# Altium project Motor Control.PrjPcb
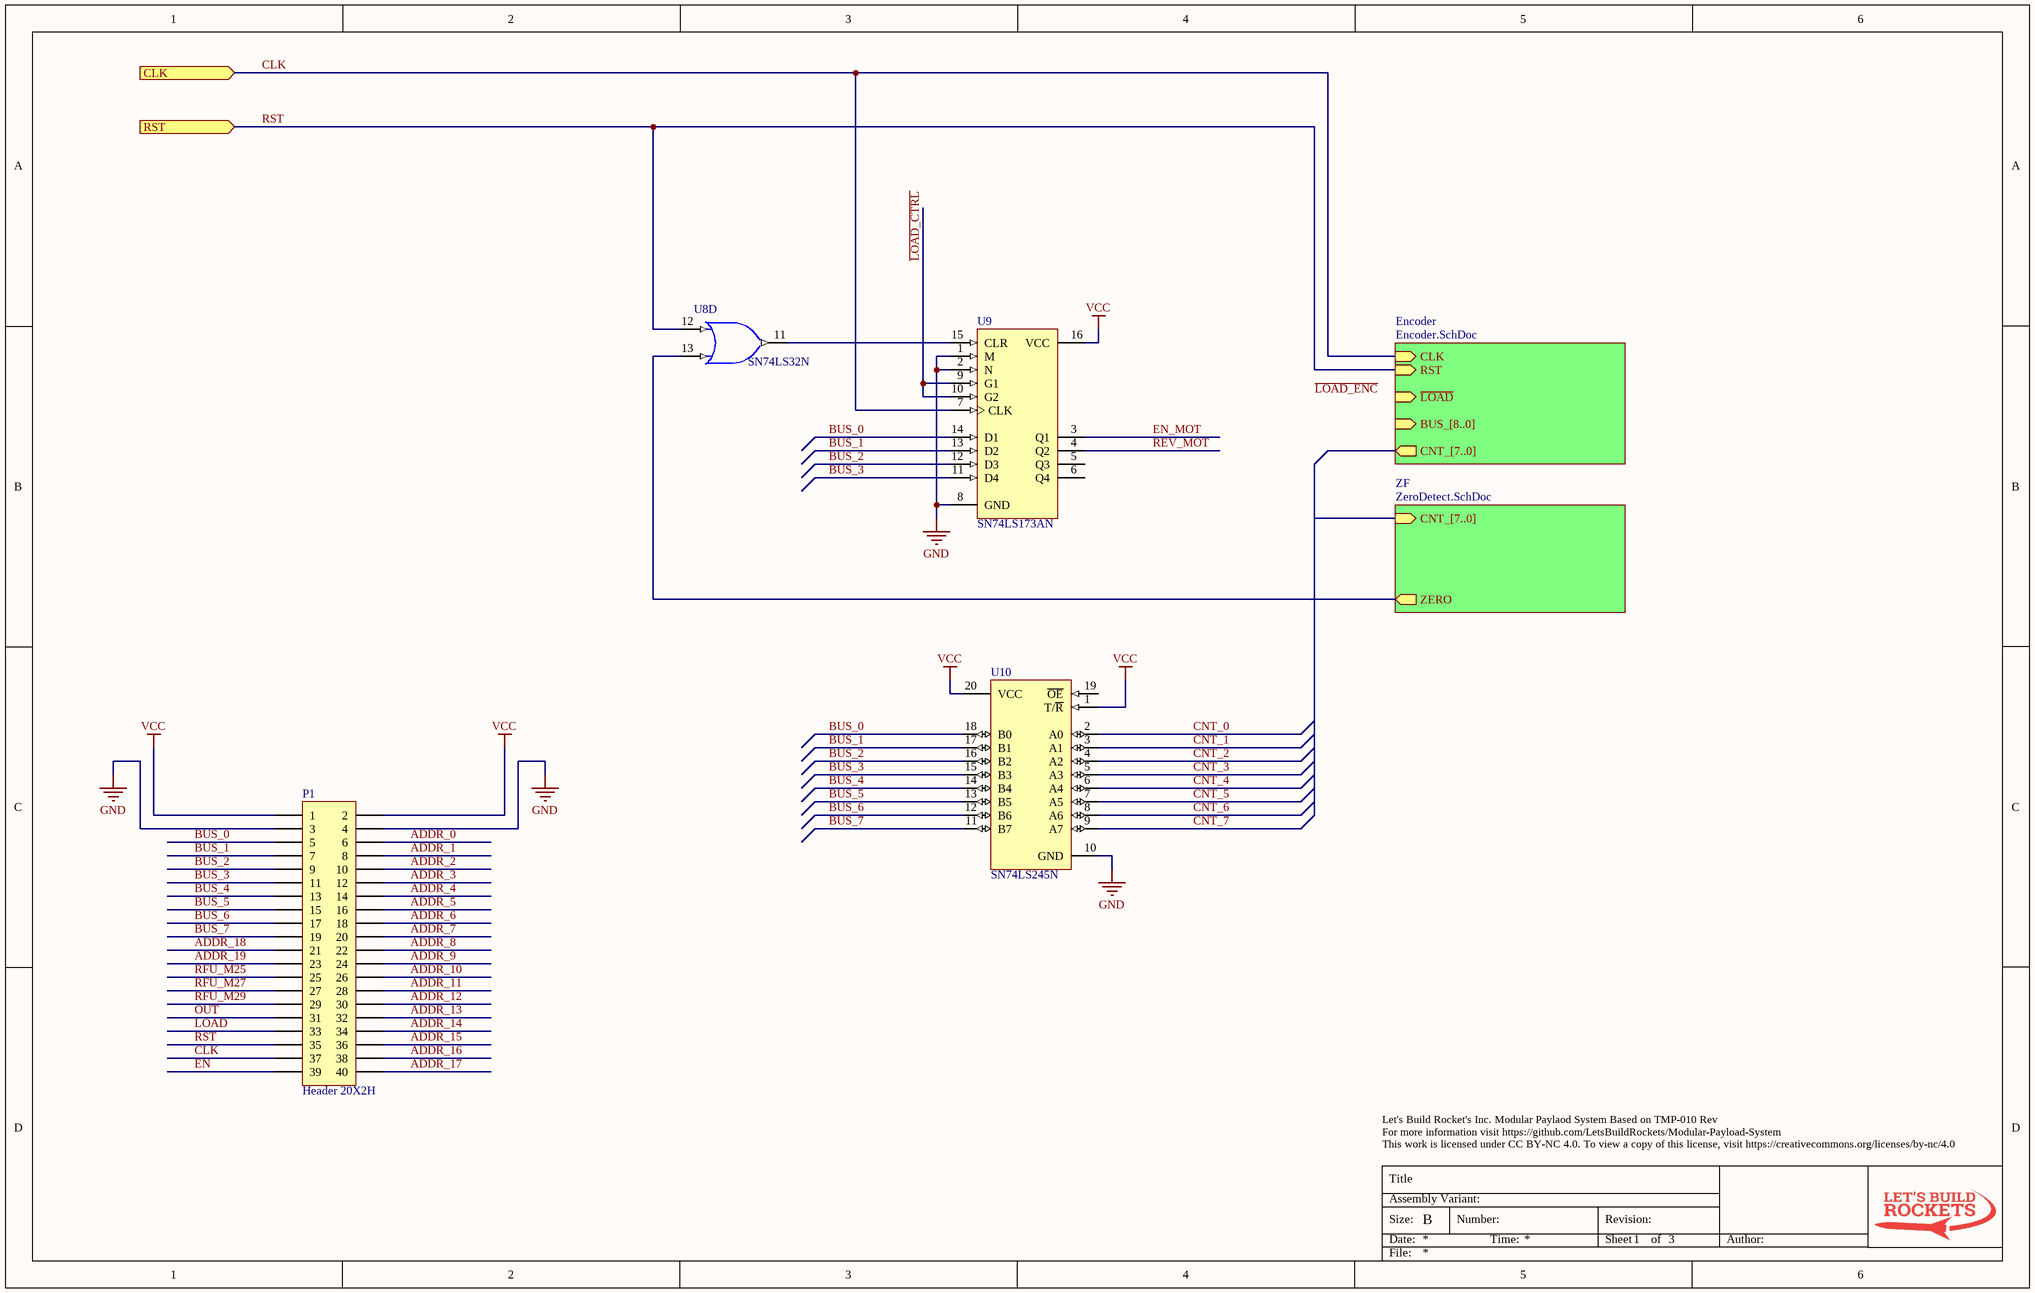
[diagram p0: Register.SchDoc]
3 sheets, 27 parts. Net scope: hierarchical (ports join the sheet entries above them; power ports are global).
Board file: Motor Control.PcbDoc
Sheets:
  Register.SchDoc
    Encoder = Encoder.SchDoc
    ZF = ZeroDetect.SchDoc

## Sheet Register.SchDoc
size B; Author: E. Sims; Organization: Let's Build Rockets Inc.; SheetNumber: 1; SheetTotal: 3

### Parts
P1  Header 20X2H  [HDR2X20H]
U8  SN74LS32N  [N014]  (part D of 4)
U9  SN74LS173AN  [N016D]
U10  SN74LS245N  [N020]

### Sub-sheets
Encoder = Encoder.SchDoc: CNT_[7..0] (out), CLK (in), RST (in), BUS_[8..0] (in), ~{LOAD} (in)
ZF = ZeroDetect.SchDoc: CNT_[7..0] (in), ZERO (out)

### Ports
CLK (in), RST (in)

### Nets
GND: P1.3 P1.4 U8.7(GND) U9.1(M) U9.2(N) U9.8(GND) U10.10(GND)
VCC: P1.1 P1.2 U8.14(VCC) U9.16(VCC) U10.1(T/~{R}) U10.20(VCC)
ADDR_0: P1.6
ADDR_1: P1.8
ADDR_2: P1.10
ADDR_3: P1.12
ADDR_4: P1.14
ADDR_5: P1.16
ADDR_6: P1.18
ADDR_7: P1.20
ADDR_8: P1.22
ADDR_9: P1.24
ADDR_10: P1.26
ADDR_11: P1.28
ADDR_12: P1.30
ADDR_13: P1.32
ADDR_14: P1.34
ADDR_15: P1.36
ADDR_16: P1.38
ADDR_17: P1.40
ADDR_18: P1.21
ADDR_19: P1.23
BUS_0: P1.5 U9.14(D1) U10.18(B0)
BUS_1: P1.7 U9.13(D2) U10.17(B1)
BUS_2: P1.9 U9.12(D3) U10.16(B2)
BUS_3: P1.11 U9.11(D4) U10.15(B3)
BUS_4: P1.13 U10.14(B4)
BUS_5: P1.15 U10.13(B5)
BUS_6: P1.17 U10.12(B6)
BUS_7: P1.19 U10.11(B7)
CLK: P1.37 U9.7(CLK) ; port CLK, sheet Encoder/CLK
CNT_0: U10.2(A0)
CNT_1: U10.3(A1)
CNT_2: U10.4(A2)
CNT_3: U10.5(A3)
CNT_4: U10.6(A4)
CNT_5: U10.7(A5)
CNT_6: U10.8(A6)
CNT_7: U10.9(A7)
EN: P1.39
EN_MOT: U9.3(Q1)
~{LOAD_CTRL}: U9.9(G1) U9.10(G2)
LOAD: P1.33
~{OUT}: P1.31
REV_MOT: U9.4(Q2)
RFU_M25: P1.25
RFU_M27: P1.27
RFU_M29: P1.29
RST: P1.35 U8.12(A) ; port RST, sheet Encoder/RST
ZERO: U8.13(B) ; sheet ZF/ZERO
NetU8_11: U8.11(Y) U9.15(CLR)

Not connected (* = marked no-connect by the designer): U9 5(Q3) 6(Q4); U10 19(~{OE})

### Buses and harness runs
bus sheet Encoder/CNT_[7..0] = sheet ZF/CNT_[7..0]

### Notes on the sheet
- Labels drawn without touching a wire or pin: ~{LOAD_ENC}
- Let's Build Rocket's Inc. Modular Paylaod System Based on TMP-010 Rev
  For more information visit https://github.com/LetsBuildRockets/Modular-Payload-System
  This work is licensed under CC BY-NC 4.0. To view a copy of this license, visit https://creativecommons.org/licenses/by-nc/4.0
- Title
- Size:
- Date:
- Assembly Variant:
- B
- Number:
- Time:
- Revision:
- Sheet
- of
- Author:
- File:

### Library data of the parts
P1 = Header 20x2H: Header, 20-Pin, Dual row, Right Angle; LatestRevisionDate: 17-Jul-2002; LatestRevisionNote: Re-released for DXP Platform.; Publisher: Altium Limited
U8 = SN74LS32N: Quadruple 2-Input Positive-OR Gate; Published: 8-Jun-2000; LatestRevisionDate: 04-Mar-2005; LatestRevisionNote: Stylized 3D Model Added.; DatasheetVersion: Mar-1988; PackageVersion: Oct-1995; PackageReference: N014; Publisher: Altium Limited; PackageDescription: DIP; 14 Leads; Row Spacing 7.62 mm; Pitch 2.54 mm; ComponentLink1Description: Manufacturer Link; ComponentLink1URL: http://www.ti.com/; ComponentLink2Description: Datasheet; ComponentLink2URL: http://www-s.ti.com/sc/ds/sn74ls32.pdf
U9 = SN74LS173AN: 4-Bit D-Type Register with 3-State Outputs; Published: 8-Jun-2000; LatestRevisionDate: 04-Mar-2005; LatestRevisionNote: Stylized 3D Model Added.; DatasheetVersion: Mar-1988; PackageVersion: Oct-1995; PackageReference: N016D; Publisher: Altium Limited; PackageDescription: DIP; 16 Leads; Row Spacing 7.62 mm; Pitch 2.54 mm; Code_JEDEC: MS-001-BB; ComponentLink1Description: Manufacturer Link; ComponentLink1URL: http://www.ti.com/; ComponentLink2Description: Datasheet; ComponentLink2URL: http://www-s.ti.com/sc/ds/sn74ls173a.pdf
U10 = SN74LS245N: Octal Bus Transceiver with 3-State Outputs; Published: 8-Jun-2000; LatestRevisionDate: 04-Mar-2005; LatestRevisionNote: Stylized 3D Model Added.; DatasheetVersion: Mar-1988; PackageVersion: Oct-1995; PackageReference: N020; Publisher: Altium Limited; PackageDescription: DIP; 20 Leads; Row Spacing 7.62 mm; Pitch 2.54 mm; ComponentLink1Description: Manufacturer Link; ComponentLink1URL: http://www.ti.com/; ComponentLink2Description: Datasheet; ComponentLink2URL: http://www-s.ti.com/sc/ds/sn74ls245.pdf

## Sheet Encoder.SchDoc
size B; Author: E. Sims; Organization: Let's Build Rockets Inc.; SheetNumber: 2; SheetTotal: 3
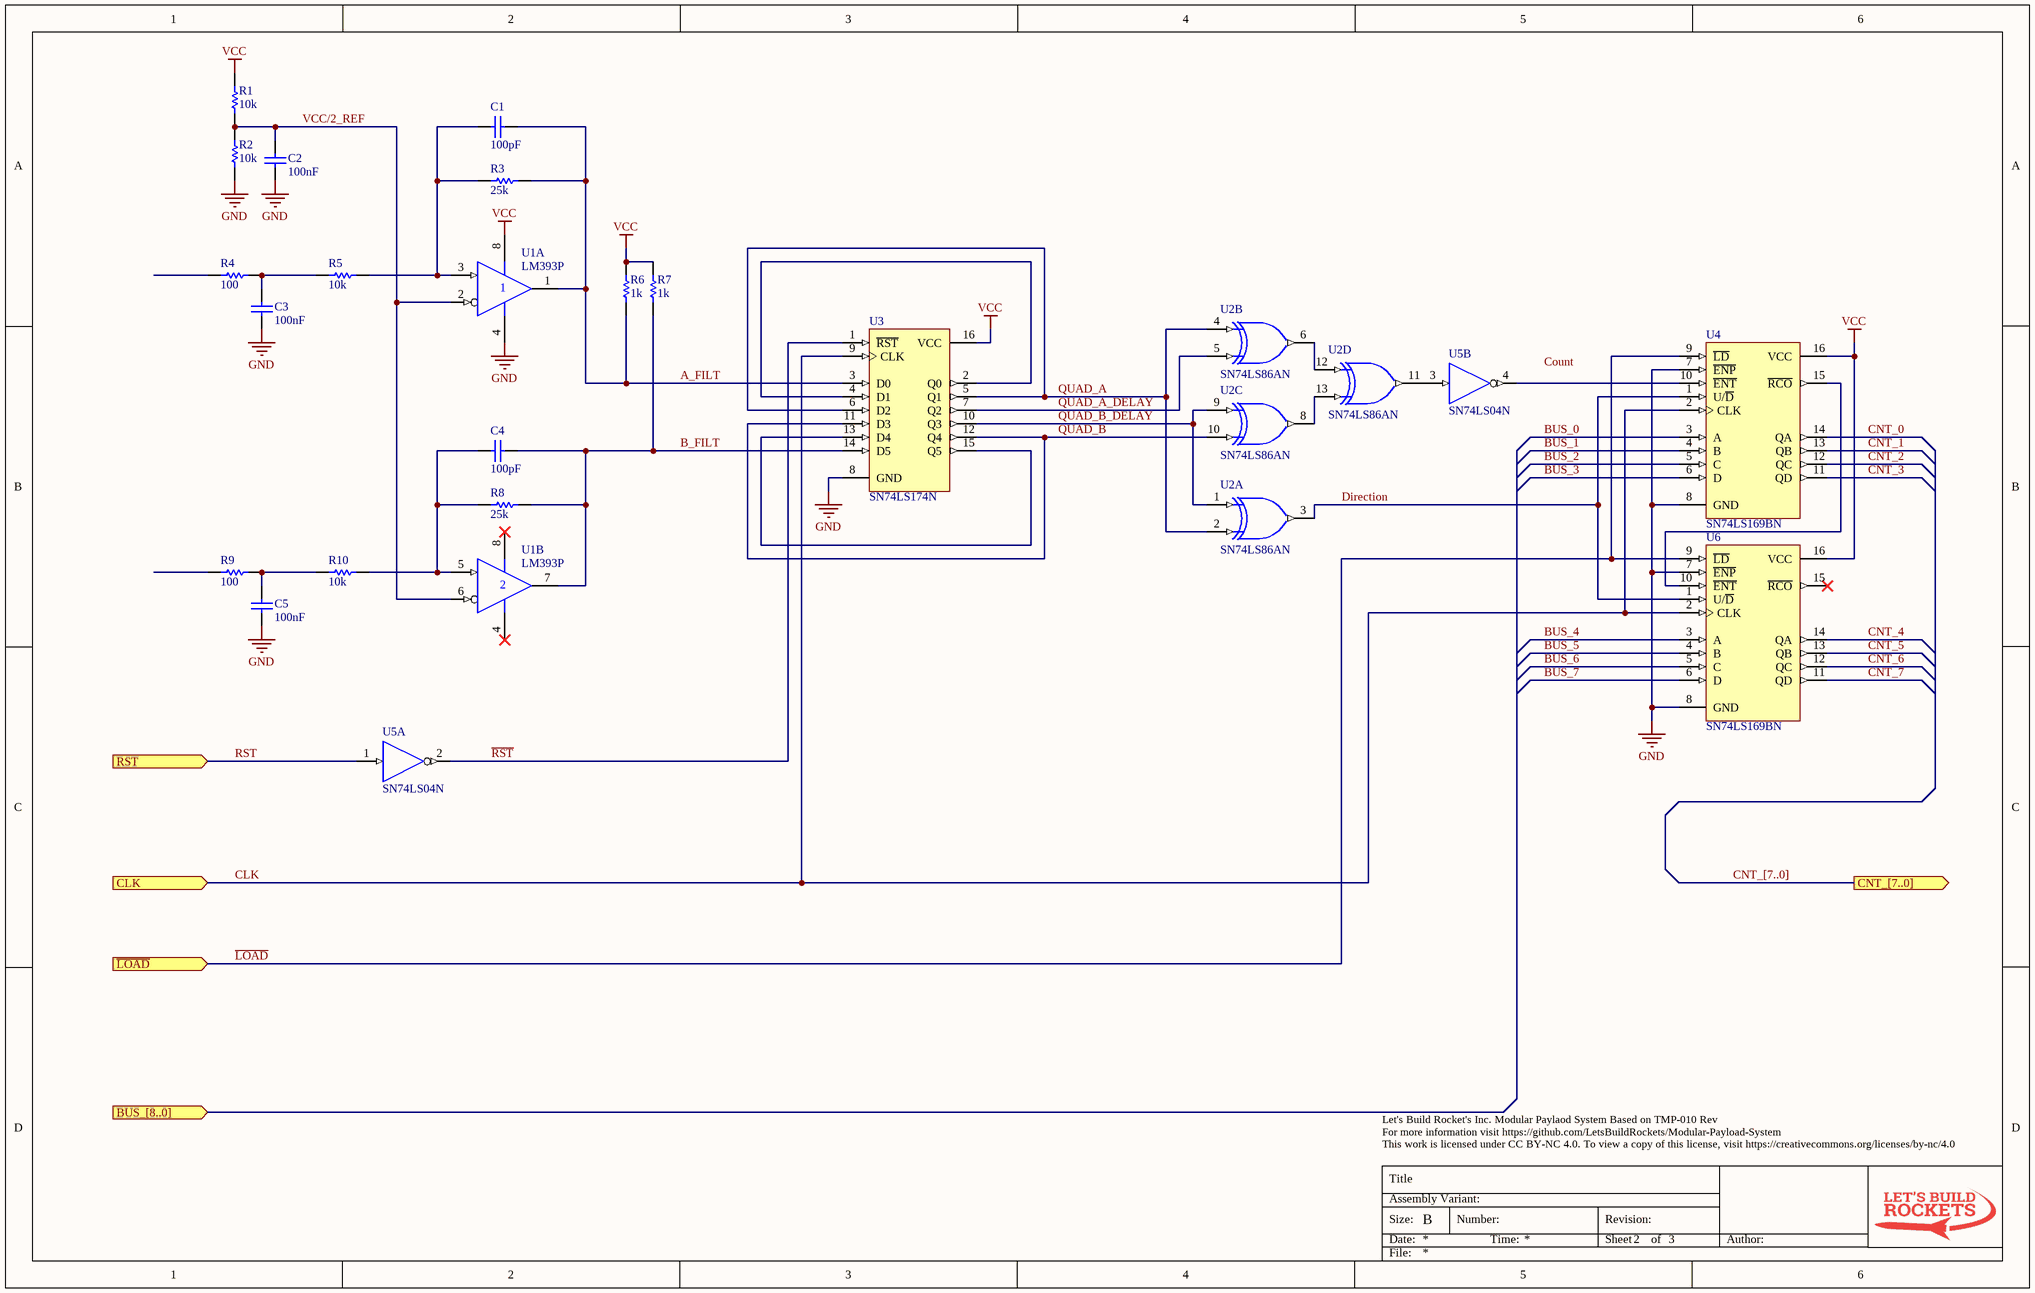
[diagram p1: Encoder.SchDoc]

### Parts
(Parts that share a designator on the sheet are numbered #1, #2 ... from top to bottom, then left to right.)
C1  value 100pF  [RAD-0.3]  (hidden comment: Cap)
C2  value 100nF  [RAD-0.3]  (hidden comment: Cap)
C3  value 100nF  [RAD-0.3]  (hidden comment: Cap)
C4  value 100pF  [RAD-0.3]  (hidden comment: Cap)
C5  value 100nF  [RAD-0.3]  (hidden comment: Cap)
R1  value 10k  [AXIAL-0.3]  (hidden comment: Res1)
R2  value 10k  [AXIAL-0.3]  (hidden comment: Res1)
R3  value 25k  [AXIAL-0.3]  (hidden comment: Res1)
R4  value 100  [AXIAL-0.3]  (hidden comment: Res1)
R5  value 10k  [AXIAL-0.3]  (hidden comment: Res1)
R6  value 1k  [AXIAL-0.3]  (hidden comment: Res1)
R7  value 1k  [AXIAL-0.3]  (hidden comment: Res1)
R8  value 25k  [AXIAL-0.3]  (hidden comment: Res1)
R9  value 100  [AXIAL-0.3]  (hidden comment: Res1)
R10  value 10k  [AXIAL-0.3]  (hidden comment: Res1)
U1#1  LM393P  [P008]  (parts A,B of 2)
U2  SN74LS86AN  [N014]  (parts A,B,C,D of 4)
U3  SN74LS174N  [N016]
U4  SN74LS169BN  [N016]
U5  SN74LS04N  [N014]  (parts A,B of 6)
U6  SN74LS169BN  [N016]

### Ports
BUS_[8..0] (in), CLK (in), CNT_[7..0] (out), RST (in), ~{LOAD} (in)

### Nets
GND: C2.2 C3.2 C5.2 R2.2 U1#1.4(GND) U2.7(GND) U3.8(GND) U4.7(~{ENP}) U4.8(GND) U5.7(GND) U6.7(~{ENP}) U6.8(GND)
VCC: R1.1 R6.1 R7.1 U1#1.8(VCC) U2.14(VCC) U3.16(VCC) U4.16(VCC) U5.14(VCC) U6.16(VCC)
A_FILT: C1.1 R3.1 R6.2 U1#1.1(OUT) U3.3(D0)
B_FILT: C4.1 R7.2 R8.1 U1#1.7(OUT) U3.14(D5)
BUS_0: U4.3(A)
BUS_1: U4.4(B)
BUS_2: U4.5(C)
BUS_3: U4.6(D)
BUS_4: U6.3(A)
BUS_5: U6.4(B)
BUS_6: U6.5(C)
BUS_7: U6.6(D)
CLK: U3.9(CLK) U4.2(CLK) U6.2(CLK) ; port CLK
CNT_0: U4.14(QA)
CNT_1: U4.13(QB)
CNT_2: U4.12(QC)
CNT_3: U4.11(QD)
CNT_4: U6.14(QA)
CNT_5: U6.13(QB)
CNT_6: U6.12(QC)
CNT_7: U6.11(QD)
Direction: U2.3(Y) U4.1(U/~{D}) U6.1(U/~{D})
~{LOAD}: U4.9(~{LD}) U6.9(~{LD}) ; port ~{LOAD}
QUAD_A: U2.2(B) U2.4(A) U3.5(Q1) U3.6(D2)
QUAD_A_DELAY: U2.5(B) U3.7(Q2)
QUAD_B: U2.10(B) U3.11(D3) U3.12(Q4)
QUAD_B_DELAY: U2.1(A) U2.9(A) U3.10(Q3)
~{RST}: U3.1(~{RST}) U5.2(Y)
RST: U5.1(A) ; port RST
VCC/2_REF: C2.1 R1.2 R2.1 U1#1.2(IN-) U1#1.6(IN-)
NetC1_2: C1.2 R3.2 R5.1 U1#1.3(IN+)
NetC3_1: C3.1 R4.1 R5.2
NetC4_2: C4.2 R8.2 R10.1 U1#1.5(IN+)
NetC5_1: C5.1 R9.1 R10.2
NetU2_6: U2.6(Y) U2.12(A)
NetU2_8: U2.8(Y) U2.13(B)
NetU2_11: U2.11(Y) U5.3(A)
NetU3_2: U3.2(Q0) U3.4(D1)
NetU3_13: U3.13(D4) U3.15(Q5)
NetU4_10: U4.10(~{ENT}) U5.4(Y)
NetU4_15: U4.15(~{RCO}) U6.10(~{ENT})

Not connected (* = marked no-connect by the designer): R4 2; R9 2; U6 15(~{RCO})*

### Buses and harness runs
bus CNT_[7..0] = port CNT_[7..0]

### Notes on the sheet
- Labels drawn without touching a wire or pin: Count
- Let's Build Rocket's Inc. Modular Paylaod System Based on TMP-010 Rev
  For more information visit https://github.com/LetsBuildRockets/Modular-Payload-System
  This work is licensed under CC BY-NC 4.0. To view a copy of this license, visit https://creativecommons.org/licenses/by-nc/4.0
- Title
- Size:
- Date:
- Assembly Variant:
- B
- Number:
- Time:
- Revision:
- Sheet
- of
- Author:
- File:

### Library data of the parts
C1-C5 = Cap: Capacitor; Published: 8-Jun-2000; LatestRevisionDate: 17-Jul-2002; LatestRevisionNote: Re-released for DXP Platform.; PackageReference: RAD-0.3; Publisher: Altium Limited; PackageDescription: Radial Cap, Thru-Hole; 2 Leads; 0.3 in Pin Spacing
R1-R10 = Res1: Resistor; Published: 8-Jun-2000; LatestRevisionDate: 17-Jul-2002; LatestRevisionNote: Re-released for DXP Platform.; PackageReference: AXIAL-0.3; Publisher: Altium Limited; PackageDescription: Axial Device, Thru-Hole; 2 Leads; 0.3 in Pin Spacing
U1#1 = LM393P: Dual Differential Comparator; Published: 15-Apr-2002; LatestRevisionDate: 04-Mar-2005; LatestRevisionNote: Stylized 3D Model Added.; DatasheetVersion: Nov-1988; PackageVersion: Jun-1999; PackageReference: P008; Publisher: Altium Limited; PackageDescription: DIP; 8 Leads; Row Spacing 7.62 mm; Pitch 2.54 mm; Code_JEDEC: MO-001-AN; ComponentLink1Description: Manufacturer Link; ComponentLink1URL: http://www.ti.com/; ComponentLink2Description: Datasheet; ComponentLink2URL: http://www-s.ti.com/sc/ds/lm193.pdf
U2 = SN74LS86AN: Quadruple 2-Input Exclusive-OR Gate; Published: 8-Jun-2000; LatestRevisionDate: 04-Mar-2005; LatestRevisionNote: Stylized 3D Model Added.; DatasheetVersion: Mar-1988; PackageVersion: Oct-1995; PackageReference: N014; Publisher: Altium Limited; PackageDescription: DIP; 14 Leads; Row Spacing 7.62 mm; Pitch 2.54 mm; ComponentLink1Description: Manufacturer Link; ComponentLink1URL: http://www.ti.com/; ComponentLink2Description: Datasheet; ComponentLink2URL: http://www-s.ti.com/sc/ds/sn74ls86a.pdf
U3 = SN74LS174N: Hex D-Type Flip-Flop with Clear; Published: 8-Jun-2000; LatestRevisionDate: 04-Mar-2005; LatestRevisionNote: Stylized 3D Model Added.; DatasheetVersion: Mar-1988; PackageVersion: Oct-1995; PackageReference: N016; Publisher: Altium Limited; PackageDescription: DIP; 16 Leads; Row Spacing 7.62 mm; Pitch 2.54 mm; Code_JEDEC: MS-001-BB; ComponentLink1Description: Manufacturer Link; ComponentLink1URL: http://www.ti.com/; ComponentLink2Description: Datasheet; ComponentLink2URL: http://www-s.ti.com/sc/ds/sn74175.pdf
U4 U6 = SN74LS169BN: Synchronous 4-Bit Up/Down Binary Counter; Published: 8-Jun-2000; LatestRevisionDate: 04-Mar-2005; LatestRevisionNote: Stylized 3D Model Added.; DatasheetVersion: Mar-1988; PackageVersion: Oct-1995; PackageReference: N016; Publisher: Altium Limited; PackageDescription: DIP; 16 Leads; Row Spacing 7.62 mm; Pitch 2.54 mm; Code_JEDEC: MS-001-BB; ComponentLink1Description: Manufacturer Link; ComponentLink1URL: http://www.ti.com/; ComponentLink2Description: Datasheet; ComponentLink2URL: http://www-s.ti.com/sc/ds/sn74ls169b.pdf
U5 = SN74LS04N: Hex Inverter; Published: 8-Jun-2000; LatestRevisionDate: 04-Mar-2005; LatestRevisionNote: Stylized 3D Model Added.; DatasheetVersion: Mar-1988; PackageVersion: Oct-1995; PackageReference: N014; Publisher: Altium Limited; PackageDescription: DIP; 14 Leads; Row Spacing 7.62 mm; Pitch 2.54 mm; ComponentLink1Description: Manufacturer Link; ComponentLink1URL: http://www.ti.com/; ComponentLink2Description: Datasheet; ComponentLink2URL: http://www-s.ti.com/sc/ds/sn74ls04.pdf

## Sheet ZeroDetect.SchDoc
size B; Author: E. Sims; Organization: Let's Build Rockets Inc.; SheetNumber: 3; SheetTotal: 3
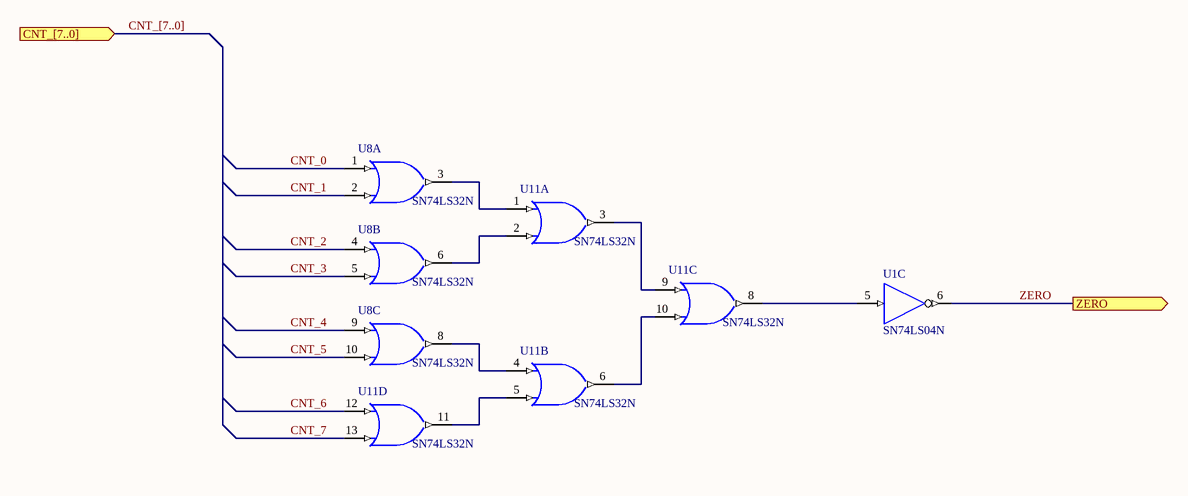
[diagram p2: ZeroDetect.SchDoc]

### Parts
(Parts that share a designator on the sheet are numbered #1, #2 ... from top to bottom, then left to right.)
U1#2  SN74LS04N  [N014]  (part C of 6)
U8  SN74LS32N  [N014]  (parts A,B,C of 4)
U11  SN74LS32N  [N014]  (parts A,B,C,D of 4)

### Ports
CNT_[7..0] (in), ZERO (out)

### Nets
GND: U1#2.7(GND) U8.7(GND) U11.7(GND)
VCC: U1#2.14(VCC) U8.14(VCC) U11.14(VCC)
CNT_0: U8.1(A)
CNT_1: U8.2(B)
CNT_2: U8.4(A)
CNT_3: U8.5(B)
CNT_4: U8.9(A)
CNT_5: U8.10(B)
CNT_6: U11.12(A)
CNT_7: U11.13(B)
ZERO: U1#2.6(Y) ; port ZERO
NetU1#2_5: U1#2.5(A) U11.8(Y)
NetU8_3: U8.3(Y) U11.1(A)
NetU8_6: U8.6(Y) U11.2(B)
NetU8_8: U8.8(Y) U11.4(A)
NetU11_3: U11.3(Y) U11.9(A)
NetU11_5: U11.5(B) U11.11(Y)
NetU11_6: U11.6(Y) U11.10(B)

### Buses and harness runs
bus CNT_[7..0] = port CNT_[7..0]

### Notes on the sheet
- Let's Build Rocket's Inc. Modular Paylaod System Based on TMP-010 Rev
  For more information visit https://github.com/LetsBuildRockets/Modular-Payload-System
  This work is licensed under CC BY-NC 4.0. To view a copy of this license, visit https://creativecommons.org/licenses/by-nc/4.0
- Title
- Size:
- Date:
- Assembly Variant:
- B
- Number:
- Time:
- Revision:
- Sheet
- of
- Author:
- File:

### Library data of the parts
U1#2 = SN74LS04N: Hex Inverter; Published: 8-Jun-2000; LatestRevisionDate: 04-Mar-2005; LatestRevisionNote: Stylized 3D Model Added.; DatasheetVersion: Mar-1988; PackageVersion: Oct-1995; PackageReference: N014; Publisher: Altium Limited; PackageDescription: DIP; 14 Leads; Row Spacing 7.62 mm; Pitch 2.54 mm; ComponentLink1Description: Manufacturer Link; ComponentLink1URL: http://www.ti.com/; ComponentLink2Description: Datasheet; ComponentLink2URL: http://www-s.ti.com/sc/ds/sn74ls04.pdf
U8 U11 = SN74LS32N: Quadruple 2-Input Positive-OR Gate; Published: 8-Jun-2000; LatestRevisionDate: 04-Mar-2005; LatestRevisionNote: Stylized 3D Model Added.; DatasheetVersion: Mar-1988; PackageVersion: Oct-1995; PackageReference: N014; Publisher: Altium Limited; PackageDescription: DIP; 14 Leads; Row Spacing 7.62 mm; Pitch 2.54 mm; ComponentLink1Description: Manufacturer Link; ComponentLink1URL: http://www.ti.com/; ComponentLink2Description: Datasheet; ComponentLink2URL: http://www-s.ti.com/sc/ds/sn74ls32.pdf

## Nets that join several sheets
GND: Register (7 pins), Encoder (12 pins), ZeroDetect (U1#2.7 U8.7 U11.7)
VCC: Register (6 pins), Encoder (9 pins), ZeroDetect (U1#2.14 U8.14 U11.14)
CLK: Register (P1.37 U9.7), Encoder (U3.9 U4.2 U6.2)
CNT_0: Encoder (U4.14), ZeroDetect (U8.1)
CNT_1: Encoder (U4.13), ZeroDetect (U8.2)
CNT_2: Encoder (U4.12), ZeroDetect (U8.4)
CNT_3: Encoder (U4.11), ZeroDetect (U8.5)
CNT_4: Encoder (U6.14), ZeroDetect (U8.9)
CNT_5: Encoder (U6.13), ZeroDetect (U8.10)
CNT_6: Encoder (U6.12), ZeroDetect (U11.12)
CNT_7: Encoder (U6.11), ZeroDetect (U11.13)
RST: Register (P1.35 U8.12), Encoder (U5.1)
ZERO: Register (U8.13), ZeroDetect (U1#2.6)